# Altium schematic sheet BatterySchematic1.SchDoc
size A; SheetNumber: 2; SheetTotal: 3
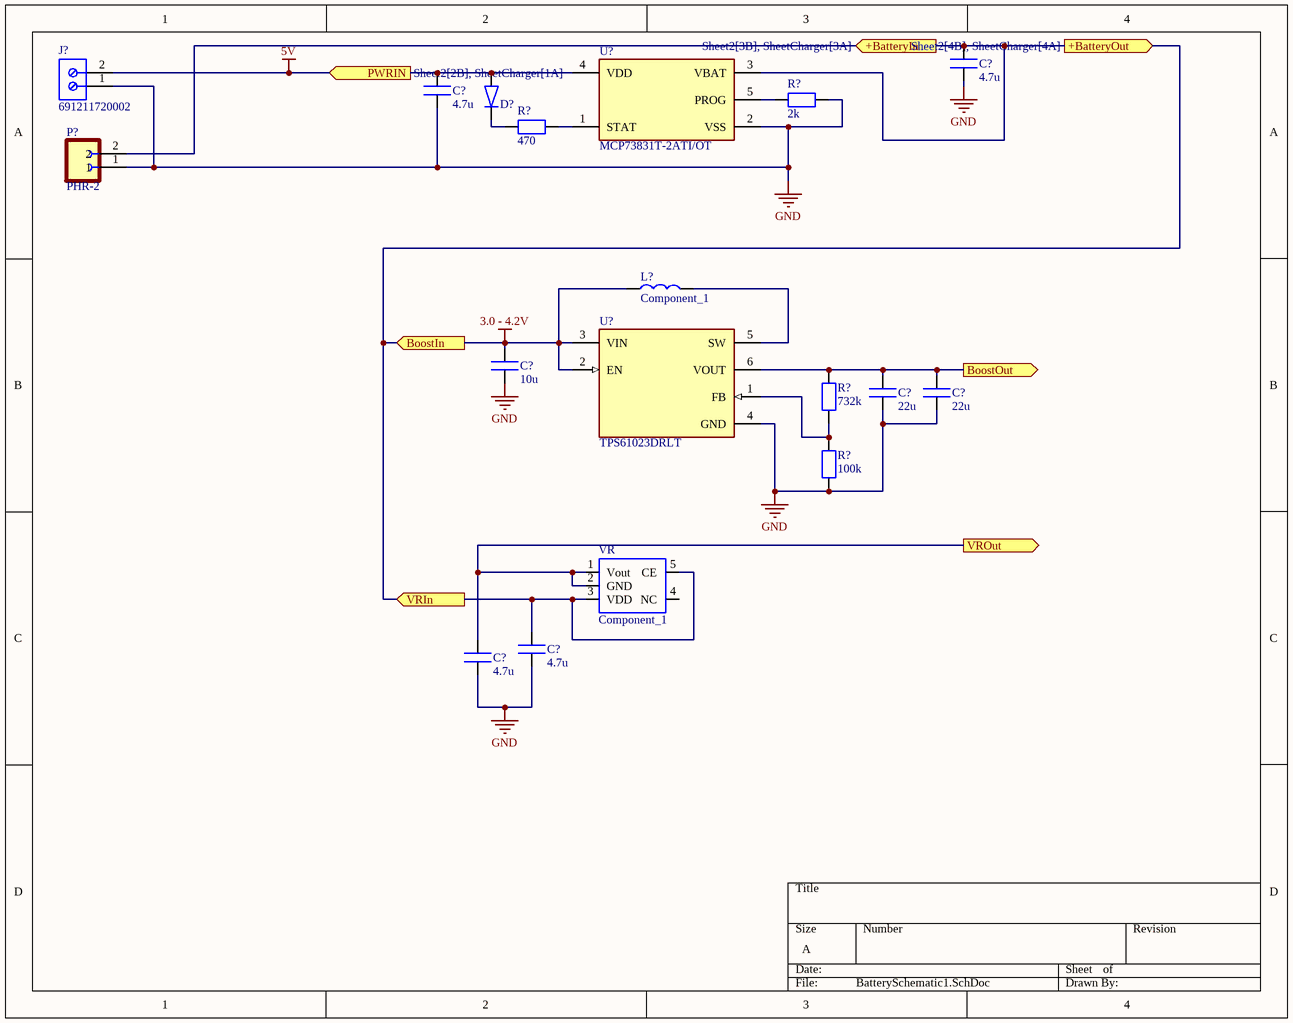
[diagram p0: BatterySchematic1.SchDoc]

## Parts
(Parts that share a designator on the sheet are numbered #1, #2 ... from top to bottom, then left to right.)
C?#1  4.7u  [PCBComponent_1]
C?#2  4.7u  [PCBComponent_1]
C?#3  10u  [PCBComponent_1]
C?#4  22u  [PCBComponent_1]
C?#5  22u  [PCBComponent_1]
C?#6  4.7u  [PCBComponent_1]
C?#7  4.7u  [PCBComponent_1]
D?  Schottky Diode  [PCBComponent_1]  (value not drawn)
J?  691211720002  [691211720002]
L?  Component_1  [PCBComponent_1]
P?  PHR-2  [PCBComponent_1]
R?#1  2k  [PCBComponent_1]
R?#2  470  [PCBComponent_1]
R?#3  732k  [PCBComponent_1]
R?#4  100k  [PCBComponent_1]
U?#1  MCP73831T-2ATI/OT  [FP-C04-091-OT-IPC_C]
U?#2  TPS61023DRLT  [FP-DRL0006A-MFG]
VR  Component_1  [PCBComponent_1]

## Ports
+BatteryIn (in, see Sheet2[3B], SheetCharger[3A]), +BatteryOut (out, see Sheet2[4B], SheetCharger[4A]), BoostIn (in), BoostOut (out), PWRIN (in, see Sheet2[2B], SheetCharger[1A]), VRIn (in), VROut (out)

## Nets
3.0 - 4.2V: C?#1.1 C?#3.2 C?#6.2 L?.1 P?.2 U?#1.3(VBAT) U?#2.2(EN) U?#2.3(VIN) VR.3(VDD) VR.5(CE) ; port +BatteryIn, port +BatteryOut, port BoostIn, port VRIn
5V: C?#2.1 D?.1 J?.2 U?#1.4(VDD) ; port PWRIN
GND: C?#1.2 C?#2.2 C?#3.1 C?#4.1 C?#5.1 C?#6.1 C?#7.2 J?.1 P?.1 R?#1.1 R?#4.1 U?#1.2(VSS) U?#2.4(GND)
BoostOut: C?#4.2 C?#5.2 R?#3.2 U?#2.6(VOUT) ; port BoostOut
VROut: C?#7.1 VR.1(Vout) VR.2(GND) ; port VROut
NetD?_2: D?.2 R?#2.1
NetL?_2: L?.2 U?#2.5(SW)
NetR?#1_2: R?#1.2 U?#1.5(PROG)
NetR?#2_2: R?#2.2 U?#1.1(STAT)
NetR?#3_1: R?#3.1 R?#4.2 U?#2.1(FB)

Not connected (* = marked no-connect by the designer): VR 4(NC)

## Library data of the parts
C?#1-C?#7 D? R?#1-R?#4 = Component_1
J? = CMP-1502-02524-1: Serie 211 - 5.00 mm 45deg Entry Modular with Rising Cage Clamp - 15.50 mm Height WR-TBL, 2 pin; Manufacturer: Wurth Elektronik; Pitch: 5.00mm; Pin Number: 2; Manufacturer URL: http://www.we-online.de; Mounting Technology: THT; Packaging: Box; Datasheet URL: http://katalog.we-online.de/em/datasheet/6912117200xx.pdf; Operating Temperature: -40to105degC; Package Reference: 691211720002; Part Number: 691211720002; Publisher: WurthElektronik
P? = PHR-2: PH Series 2 Position 2 mm Pitch Free Hanging Housing Connector; Value: *; MP: PHR-2; Package: None; Availability: Unavailable; Price: None
U?#1 = CMP-0133-00144-2: IC CONTROLLR LI-ION 4.2V SOT23-5; Max Supply Voltage: 6V; Max Output Current: 500mA; Min Output Voltage: 4.168V; Max Output Voltage: 4.232V; Min Supply Voltage: 3.75V; Number of Cells: 1; Lead Free: Lead Free; Number of Pins: 5; Package Quantity: 3000; Min Operating Temperature: -40°C; Width: 1.8mm; Max Charge Current: 500mA; Output Current: 500mA; Packaging: Tape and Reel; Height: 1.3mm; Output Voltage: 4.2V; Max Operating Temperature: 85°C; Mount: Surface Mount; Case/Package: SOT-23; Length: 3.1mm; REACH SVHC: No SVHC
U?#2 = CMP-04918-000657-1: IC REG BOOST ADJ 3A SOT563